# Altium schematic sheet Sheet_1_2025-05-28.schdoc
size 47 x 40 mm
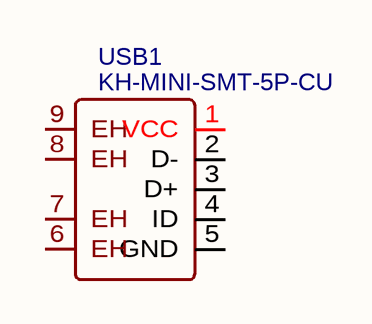
[diagram p0: Sheet_1_2025-05-28.schdoc]

## Parts
USB1  KH-MINI-SMT-5P-CU  [MINI-USB-SMD_KH-MINI-SMT-5P-CU]

## Nets

Not connected (* = marked no-connect by the designer): USB1 1(VCC) 2(D-) 3(D+) 4(ID) 5(GND) 6(EH) 7(EH) 8(EH) 9(EH)

## Library data of the parts
USB1 = KH-MINI-SMT-5P-CU: Manufacturer: kinghelm(金航标); Contributor: LCSC; Supplier: LCSC; Supplier Part: C2688795; Manufacturer Part: KH-MINI-SMT-5P-Cu; JLCPCB Part Class: Extended Part; spicePre: U; spiceSymbolName: KH-MINI-SMT-5P-CU